# Altium schematic sheet TF-CARD.SchDoc
size A4
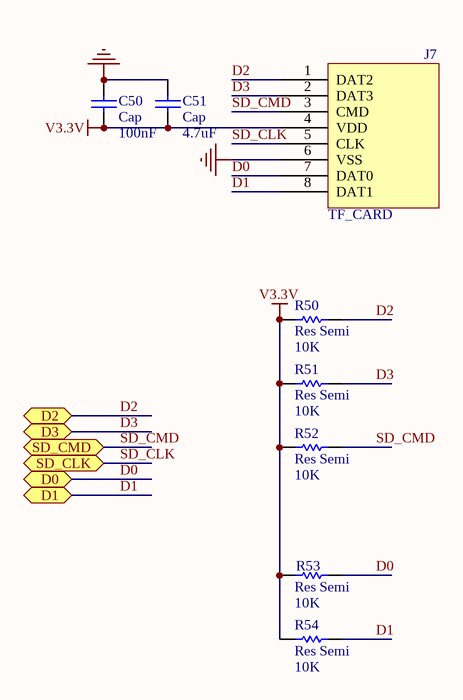
[diagram p0: TF-CARD.SchDoc]

## Parts
C50  Cap  value 100nF  [R0603N]
C51  Cap  value 4.7uF  [R0603N]
J7  TF_CARD  [TFP09-2-12B]
R50  Res Semi  value 10K  [R0603N]
R51  Res Semi  value 10K  [R0603N]
R52  Res Semi  value 10K  [R0603N]
R53  Res Semi  value 10K  [R0603N]
R54  Res Semi  value 10K  [r0603N]

## Ports
D0, D1, D2, D3, SD_CLK, SD_CMD

## Nets
GND: C50.2 C51.2 J7.6(VSS)
V3.3V: C50.1 C51.1 J7.4(VDD) R50.1 R51.1 R52.1 R53.1 R54.1
D0: J7.7(DAT0) R53.2 ; port D0
D1: J7.8(DAT1) R54.2 ; port D1
D2: J7.1(DAT2) R50.2 ; port D2
D3: J7.2(DAT3) R51.2 ; port D3
SD_CLK: J7.5(CLK) ; port SD_CLK
SD_CMD: J7.3(CMD) R52.2 ; port SD_CMD

## Library data of the parts
C50 C51 = Cap: Capacitor; Published: 8-Jun-2000; LatestRevisionDate: 17-Jul-2002; LatestRevisionNote: Re-released for DXP Platform.; PackageReference: RAD-0.3; Publisher: Altium Limited
J7 = Component_1
R50-R54 = Res Semi: Semiconductor Resistor; Published: 8-Jun-2000; LatestRevisionDate: 17-Jul-2002; LatestRevisionNote: Re-released for DXP Platform.; PackageReference: AXIAL-0.5; Publisher: Altium Limited